# EAGLE schematic tester (EAGLE 7.5.0)

## Sheet 1 of 4: BUS
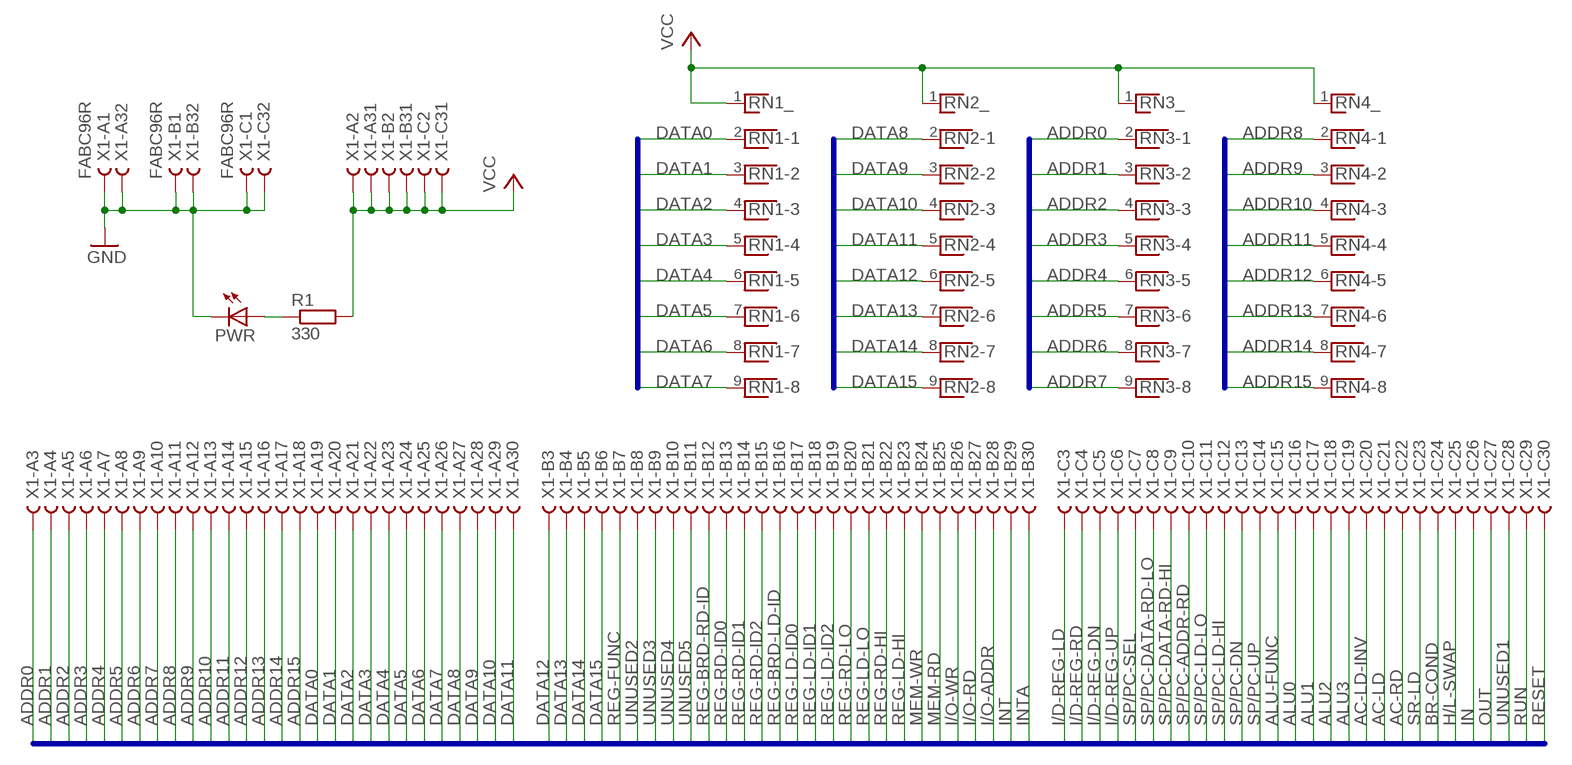
[diagram p0: schematic, sheet 1]

### Parts
PWR  LED5MM  [LED5MM]
R1  330  R0207/10  [0207/10]
RN1  RNX8  [RN-9]
RN2  RNX8  [RN-9]
RN3  RNX8  [RN-9]
RN4  RNX8  [RN-9]
X1  FABC96R  [FABC96R]

### Nets
AC-LD: X1.C21 ; also sheet 2
AC-LD-INV: X1.C20 ; also sheet 2
AC-RD: X1.C22 ; also sheet 2
ADDR0: RN3.2 X1.A3 ; also sheet 2
ADDR1: RN3.3 X1.A4 ; also sheet 2
ADDR2: RN3.4 X1.A5 ; also sheet 2
ADDR3: RN3.5 X1.A6 ; also sheet 2
ADDR4: RN3.6 X1.A7 ; also sheet 2
ADDR5: RN3.7 X1.A8 ; also sheet 2
ADDR6: RN3.8 X1.A9 ; also sheet 2
ADDR7: RN3.9 X1.A10 ; also sheet 2
ADDR8: RN4.2 X1.A11 ; also sheet 2
ADDR9: RN4.3 X1.A12 ; also sheet 2
ADDR10: RN4.4 X1.A13 ; also sheet 2
ADDR11: RN4.5 X1.A14 ; also sheet 2
ADDR12: RN4.6 X1.A15 ; also sheet 2
ADDR13: RN4.7 X1.A16 ; also sheet 2
ADDR14: RN4.8 X1.A17 ; also sheet 2
ADDR15: RN4.9 X1.A18 ; also sheet 2
ALU0: X1.C16 ; also sheet 2
ALU1: X1.C17 ; also sheet 2
ALU2: X1.C18 ; also sheet 2
ALU3: X1.C19 ; also sheet 2
ALU-FUNC: X1.C15 ; also sheet 2
BR-COND: X1.C24 ; also sheet 2
DATA0: RN1.2 X1.A19 ; also sheet 2
DATA1: RN1.3 X1.A20 ; also sheet 2
DATA2: RN1.4 X1.A21 ; also sheet 2
DATA3: RN1.5 X1.A22 ; also sheet 2
DATA4: RN1.6 X1.A23 ; also sheet 2
DATA5: RN1.7 X1.A24 ; also sheet 2
DATA6: RN1.8 X1.A25 ; also sheet 2
DATA7: RN1.9 X1.A26 ; also sheet 2
DATA8: RN2.2 X1.A27 ; also sheet 2
DATA9: RN2.3 X1.A28 ; also sheet 2
DATA10: RN2.4 X1.A29 ; also sheet 2
DATA11: RN2.5 X1.A30 ; also sheet 2
DATA12: RN2.6 X1.B3 ; also sheet 2
DATA13: RN2.7 X1.B4 ; also sheet 2
DATA14: RN2.8 X1.B5 ; also sheet 2
DATA15: RN2.9 X1.B6 ; also sheet 2
GND: PWR.K(C) X1.A1 X1.A32 X1.B1 X1.B32 X1.C1 X1.C32 ; also sheet 2,3,4
H/L-SWAP: X1.C25 ; also sheet 2
I/D-REG-DN: X1.C5 ; also sheet 2
I/D-REG-LD: X1.C3 ; also sheet 2
I/D-REG-RD: X1.C4 ; also sheet 2
I/D-REG-UP: X1.C6 ; also sheet 2
I/O-ADDR: X1.B28 ; also sheet 2
I/O-RD: X1.B27 ; also sheet 2
I/O-WR: X1.B26 ; also sheet 2
IN: X1.C26 ; also sheet 2
INT: X1.B29 ; also sheet 2
INTA: X1.B30 ; also sheet 2
MEM-RD: X1.B25 ; also sheet 2
MEM-WR: X1.B24 ; also sheet 2
N$5: PWR.A R1.1
OUT: X1.C27 ; also sheet 2
REG-BRD-LD-ID: X1.B16 ; also sheet 2
REG-BRD-RD-ID: X1.B12 ; also sheet 2
REG-FUNC: X1.B7 ; also sheet 2
REG-LD-HI: X1.B23 ; also sheet 2
REG-LD-ID0: X1.B17 ; also sheet 2
REG-LD-ID1: X1.B18 ; also sheet 2
REG-LD-ID2: X1.B19 ; also sheet 2
REG-LD-LO: X1.B21 ; also sheet 2
REG-RD-HI: X1.B22 ; also sheet 2
REG-RD-ID0: X1.B13 ; also sheet 2
REG-RD-ID1: X1.B14 ; also sheet 2
REG-RD-ID2: X1.B15 ; also sheet 2
REG-RD-LO: X1.B20 ; also sheet 2
RESET: X1.C30 ; also sheet 2
RUN: X1.C29 ; also sheet 2
SP/PC-ADDR-RD: X1.C10 ; also sheet 2
SP/PC-DATA-RD-HI: X1.C9 ; also sheet 2
SP/PC-DATA-RD-LO: X1.C8 ; also sheet 2
SP/PC-DN: X1.C13 ; also sheet 2
SP/PC-LD-HI: X1.C12 ; also sheet 2
SP/PC-LD-LO: X1.C11 ; also sheet 2
SP/PC-SEL: X1.C7 ; also sheet 2
SP/PC-UP: X1.C14 ; also sheet 2
SR-LD: X1.C23 ; also sheet 2
UNUSED1: X1.C28 ; also sheet 2
UNUSED2: X1.B8 ; also sheet 2
UNUSED3: X1.B9 ; also sheet 2
UNUSED4: X1.B10 ; also sheet 2
UNUSED5: X1.B11 ; also sheet 2
VCC: R1.2 RN1.1 RN2.1 RN3.1 RN4.1 X1.A2 X1.A31 X1.B2 X1.B31 X1.C2 X1.C31 ; also sheet 2,3,4

### Buses
ADDR[0..15],DATA[0..15],CNTL[0..48]
ADDR[0..15],DATA[0..15],REG-FUNC,REG-BRD-RD-ID,REG-RD-ID[0..2],REG-BRD-LD-ID,REG-LD-ID[0..2],REG-RD-LO,REG-LD-LO,REG-RD-HI,REG-LD-HI,MEM-WR,MEM-RD,I/O-WR,I/O-RD,I/O-ADDR,INT,INTA,I/D-REG-LD,I/D-REG-RD,I/D-REG-DN,I/D-REG-UP,SP/PC-SEL,SP/PC-DATA-RD-LO,SP/PC-DATA-RD-HI,SP/PC-ADDR-RD,SP/PC-LD-LO,SP/PC-LD-HI,SP/PC-DN,SP/PC-UP,ALU-FUNC,ALU[0..3],AC-LD-INV,AC-LD,AC-RD,SR-LD,BR-COND,H/L-SWAP,IN,OUT,UNUSED[1..5],RUN,RESET

## Sheet 2 of 4: bus cntl
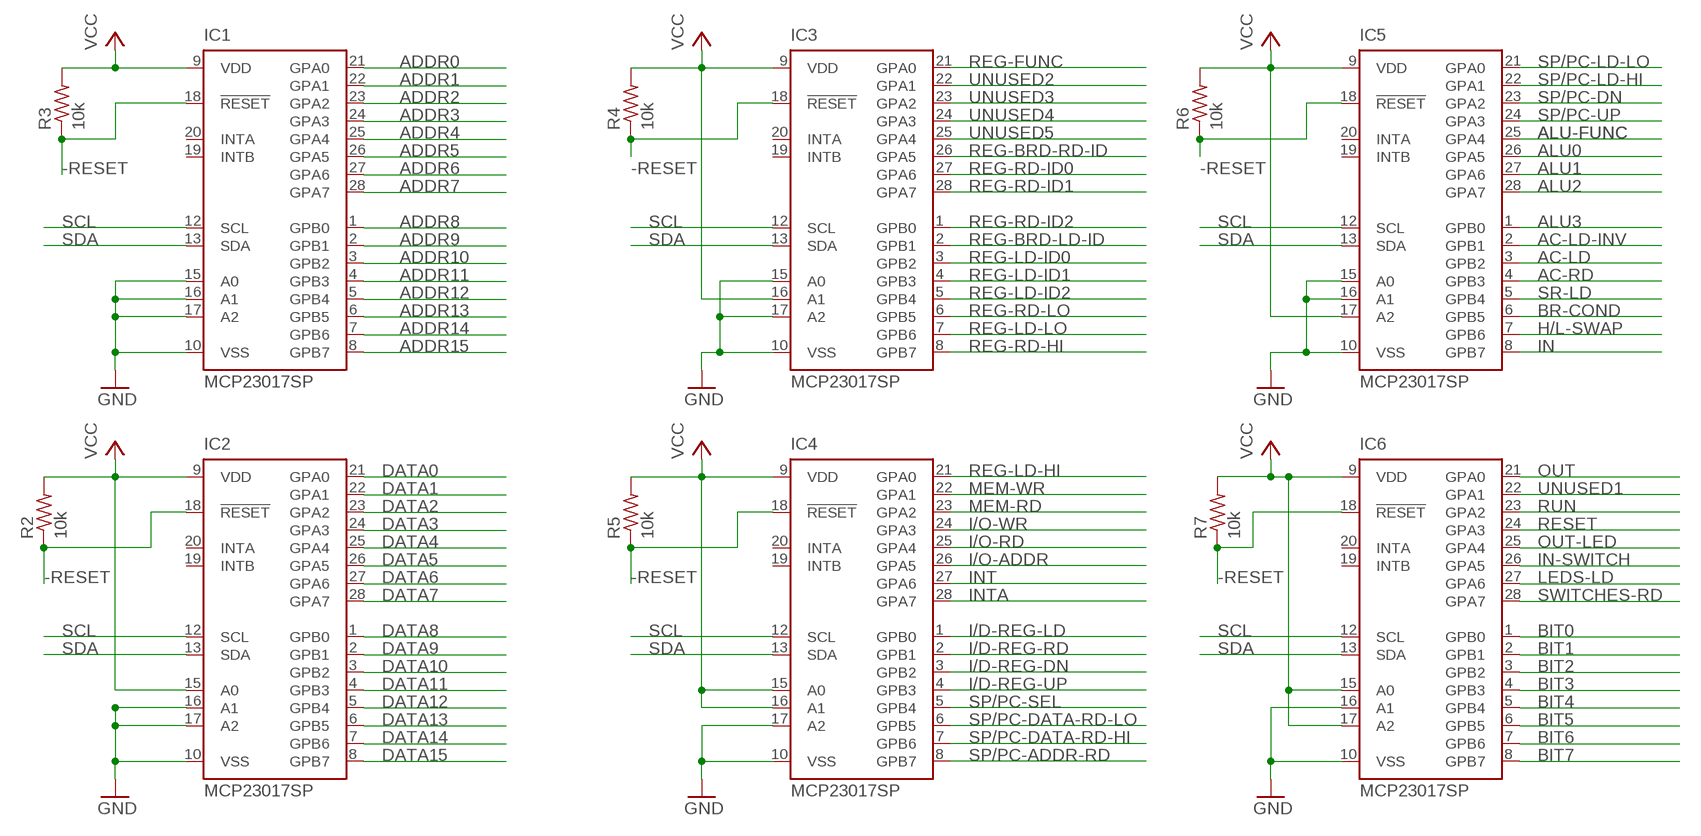
[diagram p1: schematic, sheet 2]

### Parts
IC1  MCP23017SP  [DIL28-3]
IC2  MCP23017SP  [DIL28-3]
IC3  MCP23017SP  [DIL28-3]
IC4  MCP23017SP  [DIL28-3]
IC5  MCP23017SP  [DIL28-3]
IC6  MCP23017SP  [DIL28-3]
R2  10k  R-US_0207/10  [0207/10]
R3  10k  R-US_0207/10  [0207/10]
R4  10k  R-US_0207/10  [0207/10]
R5  10k  R-US_0207/10  [0207/10]
R6  10k  R-US_0207/10  [0207/10]
R7  10k  R-US_0207/10  [0207/10]

### Nets
-RESET: IC1.18(!RESET) IC2.18(!RESET) IC3.18(!RESET) IC4.18(!RESET) IC5.18(!RESET) IC6.18(!RESET) R2.1 R3.1 R4.1 R5.1 R6.1 R7.1 ; also sheet 3
AC-LD: IC5.3(GPB2) ; also sheet 1
AC-LD-INV: IC5.2(GPB1) ; also sheet 1
AC-RD: IC5.4(GPB3) ; also sheet 1
ADDR0: IC1.21(GPA0) ; also sheet 1
ADDR1: IC1.22(GPA1) ; also sheet 1
ADDR2: IC1.23(GPA2) ; also sheet 1
ADDR3: IC1.24(GPA3) ; also sheet 1
ADDR4: IC1.25(GPA4) ; also sheet 1
ADDR5: IC1.26(GPA5) ; also sheet 1
ADDR6: IC1.27(GPA6) ; also sheet 1
ADDR7: IC1.28(GPA7) ; also sheet 1
ADDR8: IC1.1(GPB0) ; also sheet 1
ADDR9: IC1.2(GPB1) ; also sheet 1
ADDR10: IC1.3(GPB2) ; also sheet 1
ADDR11: IC1.4(GPB3) ; also sheet 1
ADDR12: IC1.5(GPB4) ; also sheet 1
ADDR13: IC1.6(GPB5) ; also sheet 1
ADDR14: IC1.7(GPB6) ; also sheet 1
ADDR15: IC1.8(GPB7) ; also sheet 1
ALU0: IC5.26(GPA5) ; also sheet 1
ALU1: IC5.27(GPA6) ; also sheet 1
ALU2: IC5.28(GPA7) ; also sheet 1
ALU3: IC5.1(GPB0) ; also sheet 1
ALU-FUNC: IC5.25(GPA4) ; also sheet 1
BIT0: IC6.1(GPB0) ; also sheet 4
BIT1: IC6.2(GPB1) ; also sheet 4
BIT2: IC6.3(GPB2) ; also sheet 4
BIT3: IC6.4(GPB3) ; also sheet 4
BIT4: IC6.5(GPB4) ; also sheet 4
BIT5: IC6.6(GPB5) ; also sheet 4
BIT6: IC6.7(GPB6) ; also sheet 4
BIT7: IC6.8(GPB7) ; also sheet 4
BR-COND: IC5.6(GPB5) ; also sheet 1
DATA0: IC2.21(GPA0) ; also sheet 1
DATA1: IC2.22(GPA1) ; also sheet 1
DATA2: IC2.23(GPA2) ; also sheet 1
DATA3: IC2.24(GPA3) ; also sheet 1
DATA4: IC2.25(GPA4) ; also sheet 1
DATA5: IC2.26(GPA5) ; also sheet 1
DATA6: IC2.27(GPA6) ; also sheet 1
DATA7: IC2.28(GPA7) ; also sheet 1
DATA8: IC2.1(GPB0) ; also sheet 1
DATA9: IC2.2(GPB1) ; also sheet 1
DATA10: IC2.3(GPB2) ; also sheet 1
DATA11: IC2.4(GPB3) ; also sheet 1
DATA12: IC2.5(GPB4) ; also sheet 1
DATA13: IC2.6(GPB5) ; also sheet 1
DATA14: IC2.7(GPB6) ; also sheet 1
DATA15: IC2.8(GPB7) ; also sheet 1
GND: IC1.10(VSS) IC1.15(A0) IC1.16(A1) IC1.17(A2) IC2.10(VSS) IC2.16(A1) IC2.17(A2) IC3.10(VSS) IC3.15(A0) IC3.17(A2) IC4.10(VSS) IC4.17(A2) IC5.10(VSS) IC5.15(A0) IC5.16(A1) IC6.10(VSS) IC6.16(A1) ; also sheet 1,3,4
H/L-SWAP: IC5.7(GPB6) ; also sheet 1
I/D-REG-DN: IC4.3(GPB2) ; also sheet 1
I/D-REG-LD: IC4.1(GPB0) ; also sheet 1
I/D-REG-RD: IC4.2(GPB1) ; also sheet 1
I/D-REG-UP: IC4.4(GPB3) ; also sheet 1
I/O-ADDR: IC4.26(GPA5) ; also sheet 1
I/O-RD: IC4.25(GPA4) ; also sheet 1
I/O-WR: IC4.24(GPA3) ; also sheet 1
IN: IC5.8(GPB7) ; also sheet 1
IN-SWITCH: IC6.26(GPA5) ; also sheet 4
INT: IC4.27(GPA6) ; also sheet 1
INTA: IC4.28(GPA7) ; also sheet 1
LEDS-LD: IC6.27(GPA6) ; also sheet 4
MEM-RD: IC4.23(GPA2) ; also sheet 1
MEM-WR: IC4.22(GPA1) ; also sheet 1
OUT: IC6.21(GPA0) ; also sheet 1
OUT-LED: IC6.25(GPA4) ; also sheet 4
REG-BRD-LD-ID: IC3.2(GPB1) ; also sheet 1
REG-BRD-RD-ID: IC3.26(GPA5) ; also sheet 1
REG-FUNC: IC3.21(GPA0) ; also sheet 1
REG-LD-HI: IC4.21(GPA0) ; also sheet 1
REG-LD-ID0: IC3.3(GPB2) ; also sheet 1
REG-LD-ID1: IC3.4(GPB3) ; also sheet 1
REG-LD-ID2: IC3.5(GPB4) ; also sheet 1
REG-LD-LO: IC3.7(GPB6) ; also sheet 1
REG-RD-HI: IC3.8(GPB7) ; also sheet 1
REG-RD-ID0: IC3.27(GPA6) ; also sheet 1
REG-RD-ID1: IC3.28(GPA7) ; also sheet 1
REG-RD-ID2: IC3.1(GPB0) ; also sheet 1
REG-RD-LO: IC3.6(GPB5) ; also sheet 1
RESET: IC6.24(GPA3) ; also sheet 1
RUN: IC6.23(GPA2) ; also sheet 1
SCL: IC1.12(SCL) IC2.12(SCL) IC3.12(SCL) IC4.12(SCL) IC5.12(SCL) IC6.12(SCL) ; also sheet 3
SDA: IC1.13(SDA) IC2.13(SDA) IC3.13(SDA) IC4.13(SDA) IC5.13(SDA) IC6.13(SDA) ; also sheet 3
SP/PC-ADDR-RD: IC4.8(GPB7) ; also sheet 1
SP/PC-DATA-RD-HI: IC4.7(GPB6) ; also sheet 1
SP/PC-DATA-RD-LO: IC4.6(GPB5) ; also sheet 1
SP/PC-DN: IC5.23(GPA2) ; also sheet 1
SP/PC-LD-HI: IC5.22(GPA1) ; also sheet 1
SP/PC-LD-LO: IC5.21(GPA0) ; also sheet 1
SP/PC-SEL: IC4.5(GPB4) ; also sheet 1
SP/PC-UP: IC5.24(GPA3) ; also sheet 1
SR-LD: IC5.5(GPB4) ; also sheet 1
SWITCHES-RD: IC6.28(GPA7) ; also sheet 4
UNUSED1: IC6.22(GPA1) ; also sheet 1
UNUSED2: IC3.22(GPA1) ; also sheet 1
UNUSED3: IC3.23(GPA2) ; also sheet 1
UNUSED4: IC3.24(GPA3) ; also sheet 1
UNUSED5: IC3.25(GPA4) ; also sheet 1
VCC: IC1.9(VDD) IC2.9(VDD) IC2.15(A0) IC3.9(VDD) IC3.16(A1) IC4.9(VDD) IC4.15(A0) IC4.16(A1) IC5.9(VDD) IC5.17(A2) IC6.9(VDD) IC6.15(A0) IC6.17(A2) R2.2 R3.2 R4.2 R5.2 R6.2 R7.2 ; also sheet 1,3,4
Unconnected: IC1.19(INTB) IC1.20(INTA) IC2.19(INTB) IC2.20(INTA) IC3.19(INTB) IC3.20(INTA) IC4.19(INTB) IC4.20(INTA) IC5.19(INTB) IC5.20(INTA) IC6.19(INTB) IC6.20(INTA)

## Sheet 3 of 4: CPU
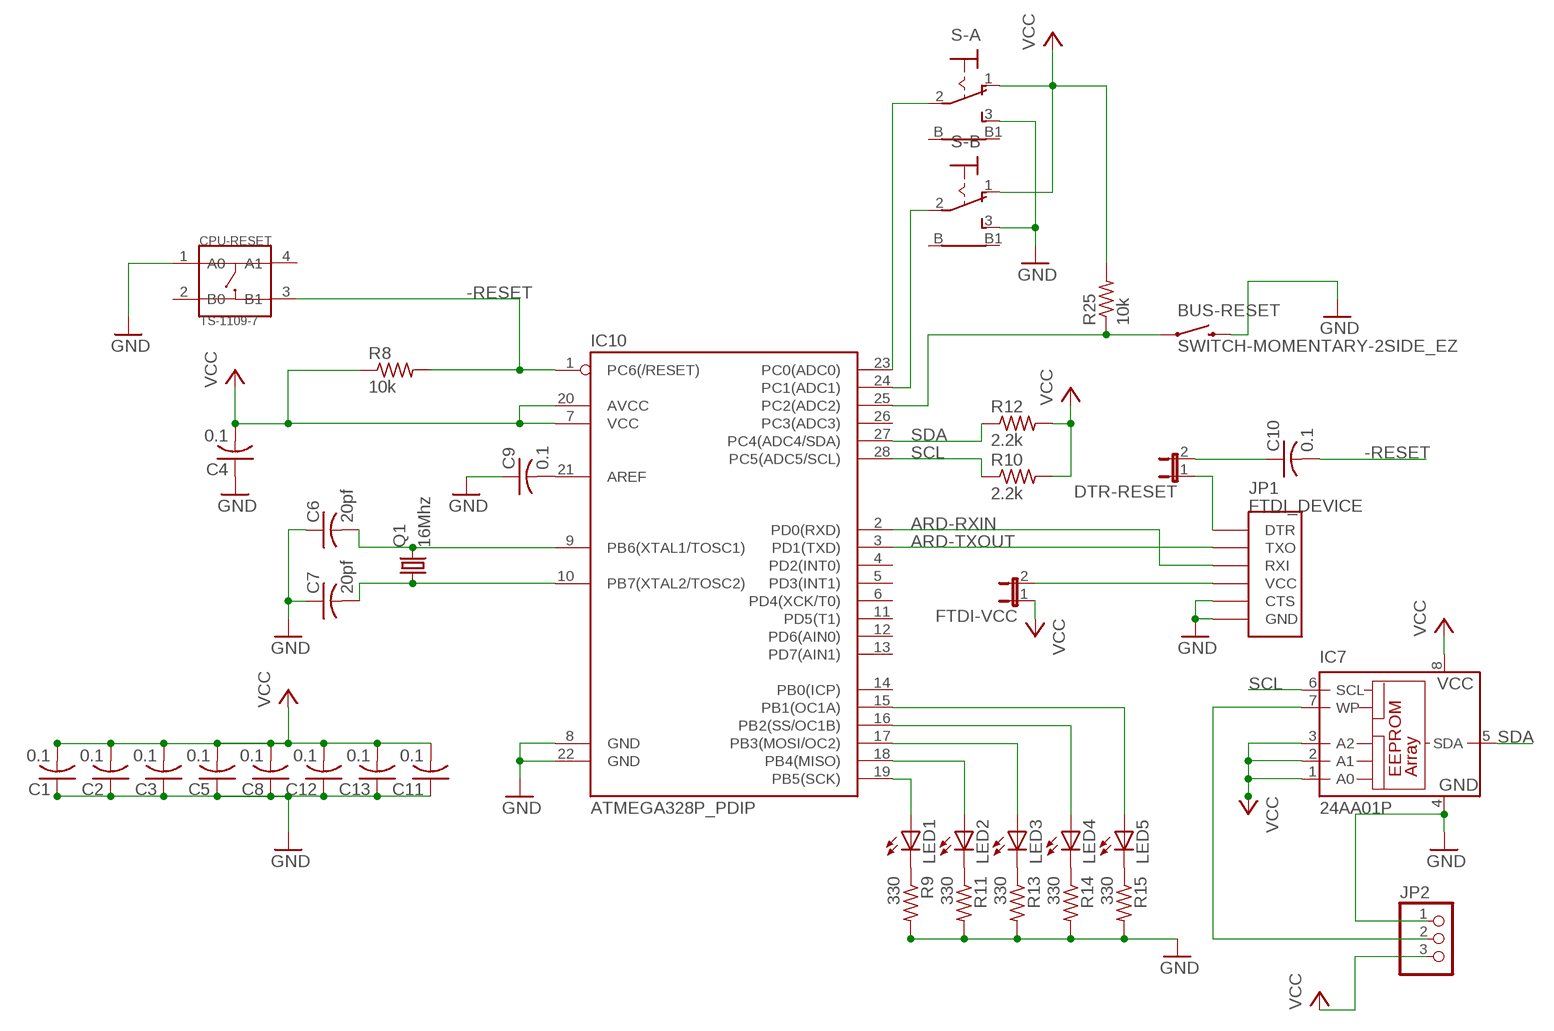
[diagram p2: schematic, sheet 3]

### Parts
BUS-RESET  SWITCH-MOMENTARY-2SIDE_EZ  [TACTILE-PTH-SIDEEZ]
C1  0.1  C-US025-024X044  [C025-024X044]
C2  0.1  C-US025-024X044  [C025-024X044]
C3  0.1  C-US025-024X044  [C025-024X044]
C4  0.1  C-US025-024X044  [C025-024X044]
C5  0.1  C-US025-024X044  [C025-024X044]
C6  20pf  C-US025-024X044  [C025-024X044]
C7  20pf  C-US025-024X044  [C025-024X044]
C8  0.1  C-US025-024X044  [C025-024X044]
C9  0.1  C-US025-024X044  [C025-024X044]
C10  0.1  C-US025-024X044  [C025-024X044]
C11  0.1  C-US025-024X044  [C025-024X044]
C12  0.1  C-US025-024X044  [C025-024X044]
C13  0.1  C-US025-024X044  [C025-024X044]
CPU-RESET  TS-1109-7  DIP-BUTTON-TOP-BLACK(4P-D6.2MM)  [SW4-6.2X6.2X5.0MM]
DTR-RESET  JP1E  [JP1]
FTDI-VCC  JP1E  [JP1]
IC7  24AA01P  [DIL8]
IC10  ATMEGA328P_PDIP  [DIL28-3]
JP1  FTDI_DEVICE  [FTDI_DEVICE_SIDE]
JP2  PINHD-1X3  [1X03]
LED1  LED5MM  [LED5MM]
LED2  LED5MM  [LED5MM]
LED3  LED5MM  [LED5MM]
LED4  LED5MM  [LED5MM]
LED5  LED5MM  [LED5MM]
Q1  16Mhz  CRYSTALHC49S  [HC49/S]
R8  10k  R-US_0207/10  [0207/10]
R9  330  R-US_0207/10  [0207/10]
R10  2.2k  R-US_0207/10  [0207/10]
R11  330  R-US_0207/10  [0207/10]
R12  2.2k  R-US_0207/10  [0207/10]
R13  330  R-US_0207/10  [0207/10]
R14  330  R-US_0207/10  [0207/10]
R15  330  R-US_0207/10  [0207/10]
R25  10k  R-US_0207/10  [0207/10]
S-A  9070-1W  [9070-1W]
S-B  9070-1W  [9070-1W]

### Nets
-RESET: C10.2 CPU-RESET.3(B1) IC10.1(PC6(/RESET)) R8.2 ; also sheet 2
ARD-RXIN: IC10.2(PD0(RXD)) JP1.P$3(RXI)
ARD-TXOUT: IC10.3(PD1(TXD)) JP1.P$2(TXO)
GND: BUS-RESET.2 C1.1 C2.1 C3.1 C4.1 C5.1 C6.1 C7.1 C8.1 C9.1 C11.1 C12.1 C13.1 CPU-RESET.1(A0) IC7.4(GND) IC10.8(GND) IC10.22(GND) JP1.P$5(CTS) JP1.P$6(GND) JP2.1 R9.2 R11.2 R13.2 R14.2 R15.2 S-A.3(S) S-B.3(S) ; also sheet 1,2,4
N$1: IC10.19(PB5(SCK)) LED1.A
N$2: IC7.7(WP) JP2.2
N$3: C6.2 IC10.9(PB6(XTAL1/TOSC1)) Q1.2
N$4: C7.2 IC10.10(PB7(XTAL2/TOSC2)) Q1.1
N$6: IC10.18(PB4(MISO)) LED2.A
N$7: IC10.17(PB3(MOSI/OC2)) LED3.A
N$8: IC10.16(PB2(SS/OC1B)) LED4.A
N$9: C10.1 DTR-RESET.2
N$10: IC10.15(PB1(OC1A)) LED5.A
N$11: LED2.K(C) R11.1
N$12: LED1.K(C) R9.1
N$13: LED3.K(C) R13.1
N$14: C9.2 IC10.21(AREF)
N$15: LED4.K(C) R14.1
N$16: LED5.K(C) R15.1
N$18: IC10.23(PC0(ADC0)) S-A.2(P)
N$19: IC10.24(PC1(ADC1)) S-B.2(P)
N$28: DTR-RESET.1 JP1.P$1(DTR)
N$29: FTDI-VCC.2 JP1.P$4(VCC)
N$39: BUS-RESET.1 IC10.25(PC2(ADC2)) R25.1
SCL: IC7.6(SCL) IC10.28(PC5(ADC5/SCL)) R10.1 ; also sheet 2
SDA: IC7.5(SDA) IC10.27(PC4(ADC4/SDA)) R12.1 ; also sheet 2
VCC: C1.2 C2.2 C3.2 C4.2 C5.2 C8.2 C11.2 C12.2 C13.2 FTDI-VCC.1 IC7.1(A0) IC7.2(A1) IC7.3(A2) IC7.8(VCC) IC10.7(VCC) IC10.20(AVCC) JP2.3 R8.1 R10.2 R12.2 R25.2 S-A.1(O) S-B.1(O) ; also sheet 1,2,4
Unconnected: CPU-RESET.2(B0) CPU-RESET.4(A1) IC10.4(PD2(INT0)) IC10.5(PD3(INT1)) IC10.6(PD4(XCK/T0)) IC10.11(PD5(T1)) IC10.12(PD6(AIN0)) IC10.13(PD7(AIN1)) IC10.14(PB0(ICP)) IC10.26(PC3(ADC3)) S-A.B S-A.B1 S-B.B S-B.B1

## Sheet 4 of 4: I/O
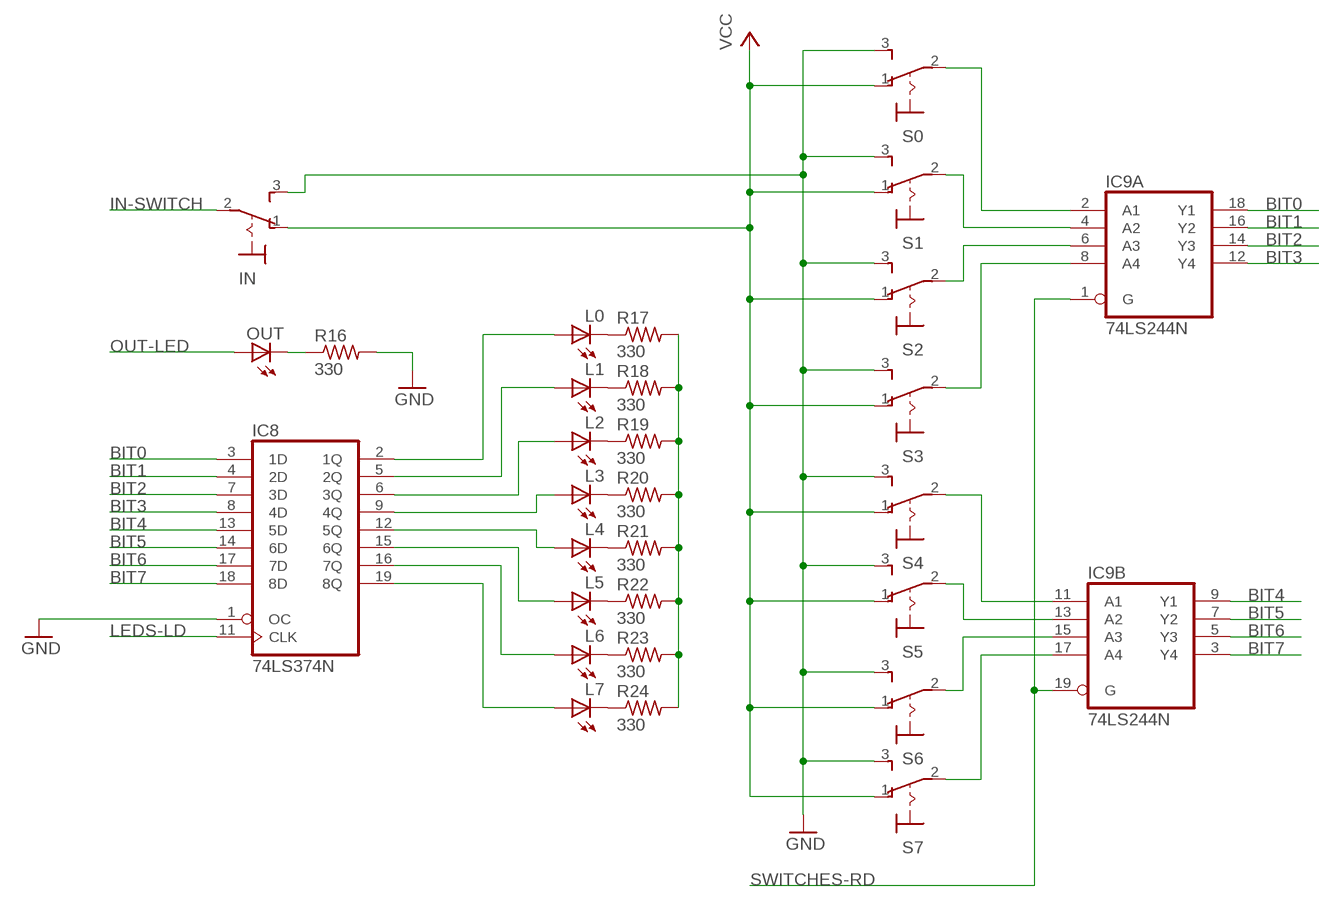
[diagram p3: schematic, sheet 4]

### Parts
IC8  74LS374N  [DIL20]
IC9  74LS244N  [DIL20]
IN  M9040P  [M9040P]
L0  LED5MM  [LED5MM]
L1  LED5MM  [LED5MM]
L2  LED5MM  [LED5MM]
L3  LED5MM  [LED5MM]
L4  LED5MM  [LED5MM]
L5  LED5MM  [LED5MM]
L6  LED5MM  [LED5MM]
L7  LED5MM  [LED5MM]
OUT  LED5MM  [LED5MM]
R16  330  R-US_0207/10  [0207/10]
R17  330  R-US_0207/10  [0207/10]
R18  330  R-US_0207/10  [0207/10]
R19  330  R-US_0207/10  [0207/10]
R20  330  R-US_0207/10  [0207/10]
R21  330  R-US_0207/10  [0207/10]
R22  330  R-US_0207/10  [0207/10]
R23  330  R-US_0207/10  [0207/10]
R24  330  R-US_0207/10  [0207/10]
S0  M9040P  [M9040P]
S1  M9040P  [M9040P]
S2  M9040P  [M9040P]
S3  M9040P  [M9040P]
S4  M9040P  [M9040P]
S5  M9040P  [M9040P]
S6  M9040P  [M9040P]
S7  M9040P  [M9040P]

### Nets
BIT0: IC8.3(1D) IC9.18(A:Y1) ; also sheet 2
BIT1: IC8.4(2D) IC9.16(A:Y2) ; also sheet 2
BIT2: IC8.7(3D) IC9.14(A:Y3) ; also sheet 2
BIT3: IC8.8(4D) IC9.12(A:Y4) ; also sheet 2
BIT4: IC8.13(5D) IC9.9(B:Y1) ; also sheet 2
BIT5: IC8.14(6D) IC9.7(B:Y2) ; also sheet 2
BIT6: IC8.17(7D) IC9.5(B:Y3) ; also sheet 2
BIT7: IC8.18(8D) IC9.3(B:Y4) ; also sheet 2
GND: IC8.1(OC) IN.3(S) R16.2 S0.3(S) S1.3(S) S2.3(S) S3.3(S) S4.3(S) S5.3(S) S6.3(S) S7.3(S) ; also sheet 1,2,3
IN-SWITCH: IN.2(P) ; also sheet 2
LEDS-LD: IC8.11(CLK) ; also sheet 2
N$17: L7.K(C) R24.1
N$20: L6.K(C) R23.1
N$21: L5.K(C) R22.1
N$22: L4.K(C) R21.1
N$23: L3.K(C) R20.1
N$24: L2.K(C) R19.1
N$25: L1.K(C) R18.1
N$26: L0.K(C) R17.1
N$27: OUT.K(C) R16.1
N$30: R17.2 R18.2 R19.2 R20.2 R21.2 R22.2 R23.2 R24.2
N$31: IC8.5(2Q) L1.A
N$32: IC8.9(4Q) L3.A
N$33: IC8.12(5Q) L4.A
N$34: IC8.15(6Q) L5.A
N$35: IC8.6(3Q) L2.A
N$36: IC8.16(7Q) L6.A
N$37: IC8.19(8Q) L7.A
N$38: IC8.2(1Q) L0.A
N$40: IC9.2(A:A1) S0.2(P)
N$41: IC9.8(A:A4) S3.2(P)
N$42: IC9.6(A:A3) S2.2(P)
N$43: IC9.4(A:A2) S1.2(P)
N$44: IC9.11(B:A1) S4.2(P)
N$45: IC9.17(B:A4) S7.2(P)
N$46: IC9.13(B:A2) S5.2(P)
N$47: IC9.15(B:A3) S6.2(P)
OUT-LED: OUT.A ; also sheet 2
SWITCHES-RD: IC9.1(A:G) IC9.19(B:G) ; also sheet 2
VCC: IN.1(O) S0.1(O) S1.1(O) S2.1(O) S3.1(O) S4.1(O) S5.1(O) S6.1(O) S7.1(O) ; also sheet 1,2,3

## Power pins joined to a net without a drawn wire
GND: IC8.10(GND) IC9.10(P:GND)
VCC: IC8.20(VCC) IC9.20(P:VCC)

## Library data of the parts
BUS-RESET = SparkFun-Electromechanical:SWITCH-MOMENTARY-2: Various NO switches- pushbuttons, reed, etc
C1-C13 = adafruit:C-US: CAPACITOR, American symbol
CPU-RESET = Seeed-OPL-Switch:DIP-BUTTON-TOP-BLACK(4P-D6.2MM): 311020032; MPN: TS-1109-7
DTR-RESET FTDI-VCC = jumper:JP1E: JUMPER
IC1-IC6 = microchip:MCP23017: http://ww1.microchip.com/downloads/en/DeviceDoc/21952a.pdf Source: http://ww1.microchip.com/downloads/en/DeviceDoc/21952a.pdf; MF: MICROCHIP; MPN: MCP23017-E/SP; OC_FARNELL: 1332088; OC_NEWARK: 31K2959
IC7 = microchip:24*: Serial EEPROM I2C; MPN: 24AA01-I/P; OC_FARNELL: 1331266; OC_NEWARK: 35M0692
IC8 = 74xx-us:74*374: Octal D type transparent LATCH, edge triggered
IC9 = 74xx-us:74*244: Octal BUFFER and LINE DRIVER, 3-state
IC10 = SparkFun-DigitalIC:ATMEGA328P_PDIP: uC used in the Arduino 32kb flash, 1k EEPROM, 2k SRAM This is the through-hole version of this chip.
IN S0 S1-S7 = switch:M9040P: TOGGLE SWITCH Marquardt
JP1 = SparkFun-Connectors:FTDI_DEVICE: Connector which mates to FTDI basic or FTDI cable.
JP2 = pinhead:PINHD-1X3: PIN HEADER
L0 L1-L7 LED1-LED5 OUT PWR = led:LED: LED OSRAM: - CHIPLED LG R971, LG N971, LY N971, LG Q971, LY Q971, LO R971, LY R971 LH N974, LH R974 LS Q976, LO Q976, LY Q976 LO Q996 - Hyper CHIPLED LW Q18S LB Q993, LB Q99A, LB R99A - SideLED LS A670, LO A670, LY A670, LG A670, LP A670 LB A673, LV A673, LT A673, LW A673 LH A674 LY A675 LS A676, LA A676, LO A676, LY A676, LW A676 LS A679, LY A679, LG A679 - Hyper Micro SIDELED® LS Y876, LA Y876, LO Y876, LY Y876 LT Y87S - SmartLED LW L88C, LW L88S LB L89C, LB L89S, LG L890 LS L89K, LO L89K, LY L89K LS L896, LA L896, LO L896, LY L896 - TOPLED LS T670, LO T670, LY T670, LG T670, LP T670 LSG T670, LSP T670, LSY T670, LOP T670, LYG T670 LG T671, LOG T671, LSG T671 LB T673, LV T673, LT T673, LW T673 LH T674 LS T676, LA T676, LO T676, LY T676, LB T676, LH T676, LSB T676, LW T676 LB T67C, LV T67C, LT T67C, LS T67K, LO T67K, LY T67K, LW E67C LS E67B, LA E67B, LO E67B, LY E67B, LB E67C, LV E67C, LT E67C LW T67C LS T679, LY T679, LG T679 LS T770, LO T770, LY T770, LG T770, LP T770 LB T773, LV T773, LT T773, LW T773 LH T774 LS E675, LA E675, LY E675, LS T675 LS T776, LA T776, LO T776, LY T776, LB T776 LHGB T686 LT T68C, LB T68C - Hyper Mini TOPLED® LB M676 - Mini TOPLED Santana® LG M470 LS M47K, LO M47K, LY M47K Source: http://www.osram.convergy.de LUXEON: - LUMILED® LXK2-PW12-R00, LXK2-PW12-S00, LXK2-PW14-U00, LXK2-PW14-V00 LXK2-PM12-R00, LXK2-PM12-S00, LXK2-PM14-U00 LXK2-PE12-Q00, LXK2-PE12-R00, LXK2-PE12-S00, LXK2-PE14-T00, LXK2-PE14-U00 LXK2-PB12-K00, LXK2-PB12-L00, LXK2-PB12-M00, LXK2-PB14-N00, LXK2-PB14-P00, LXK2-PB14-Q00 LXK2-PR12-L00, LXK2-PR12-M00, LXK2-PR14-Q00, LXK2-PR14-R00 LXK2-PD12-Q00, LXK2-PD12-R00, LXK2-PD12-S00 LXK2-PH12-R00, LXK2-PH12-S00 LXK2-PL12-P00, LXK2-PL12-Q00, LXK2-PL12-R00 Source: www.luxeon.com KINGBRIGHT: KA-3528ASYC Source: www.kingbright.com
Q1 = crystal:CRYSTAL: CRYSTAL; OC_FARNELL: 1667008; OC_NEWARK: unknown
R1 = eagle-ltspice:R: RESISTOR, European symbol; SPICEMODEL: NONE; SPICEPREFIX: R
R2-R7 = adafruit:R-US_: RESISTOR, American symbol
R8-R25 = resistor:R-US_: RESISTOR, American symbol
RN1-RN4 = resistor-net:RNX8: RESISTOR NETWORK; OC_FARNELL: unknown; OC_NEWARK: unknown
S-A S-B = switch:9070-1W: TOGGLE SWITCH Marquardt
X1 = con-vg:FABC96R: CONNECTOR female, 96 pins, type R, rows ABC, grid 2.54 mm